# EAGLE schematic id12-breakout (EAGLE 5.10)
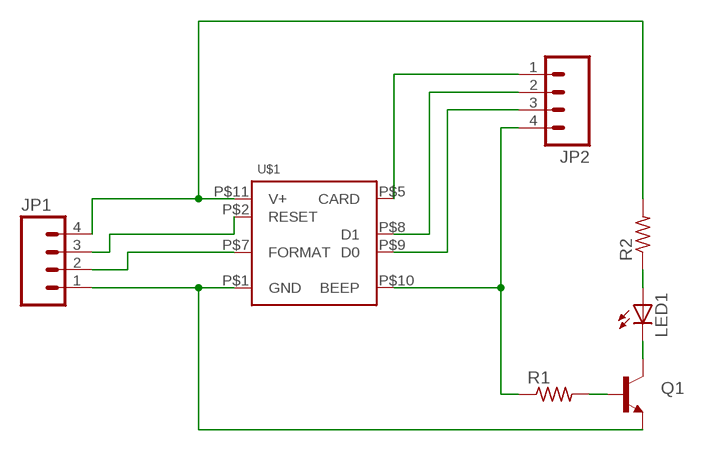
[diagram p0: schematic, sheet 1]

## Parts
JP1  M04LOCK  [1X04_LOCK]
JP2  M04LOCK  [1X04_LOCK]
LED1  LEDCHIP-LED0805  [CHIP-LED0805]
Q1  TRANSISTOR_NPNSOT23  [SOT23]
R1  R-US_M0805  [M0805]
R2  R-US_M0805  [M0805]
U$1  ID-12  [ID-12]

## Nets
N$1: JP2.4 R1.1 U$1.P$10(BEEP)
N$2: Q1.1(B) R1.2
N$3: LED1.C Q1.3(C)
N$4: LED1.A R2.1
N$5: JP1.1 Q1.2(E) U$1.P$1(GND)
N$6: JP1.4 R2.2 U$1.P$11(V+)
N$7: JP1.3 U$1.P$2(RESET)
N$8: JP1.2 U$1.P$7(FORMAT)
N$9: JP2.1 U$1.P$5(CARD)
N$10: JP2.2 U$1.P$8(D1)
N$11: JP2.3 U$1.P$9(D0)

## Library data of the parts
JP1 JP2 = SparkFun:M04: Header 4 Standard 4-pin 0.1" header. Use with straight break away headers (SKU : PRT-00116), right angle break away headers (PRT-00553), swiss pins (PRT-00743), machine pins (PRT-00117), and female headers (PRT-00115). Molex polarized connector foot print use with SKU : PRT-08231 with associated crimp pins and housings. 1MM SMD Version SKU: PRT-10208
LED1 = adafruit:LED: LED OSRAM: - CHIPLED LG R971, LG N971, LY N971, LG Q971, LY Q971, LO R971, LY R971 LH N974, LH R974 LS Q976, LO Q976, LY Q976 LO Q996 - Hyper CHIPLED LW Q18S LB Q993, LB Q99A, LB R99A - SideLED LS A670, LO A670, LY A670, LG A670, LP A670 LB A673, LV A673, LT A673, LW A673 LH A674 LY A675 LS A676, LA A676, LO A676, LY A676, LW A676 LS A679, LY A679, LG A679 - Hyper Micro SIDELED® LS Y876, LA Y876, LO Y876, LY Y876 LT Y87S - SmartLED LW L88C, LW L88S LB L89C, LB L89S, LG L890 LS L89K, LO L89K, LY L89K LS L896, LA L896, LO L896, LY L896 - TOPLED LS T670, LO T670, LY T670, LG T670, LP T670 LSG T670, LSP T670, LSY T670, LOP T670, LYG T670 LG T671, LOG T671, LSG T671 LB T673, LV T673, LT T673, LW T673 LH T674 LS T676, LA T676, LO T676, LY T676, LB T676, LH T676, LSB T676, LW T676 LB T67C, LV T67C, LT T67C, LS T67K, LO T67K, LY T67K, LW E67C LS E67B, LA E67B, LO E67B, LY E67B, LB E67C, LV E67C, LT E67C LW T67C LS T679, LY T679, LG T679 LS T770, LO T770, LY T770, LG T770, LP T770 LB T773, LV T773, LT T773, LW T773 LH T774 LS E675, LA E675, LY E675, LS T675 LS T776, LA T776, LO T776, LY T776, LB T776 LHGB T686 LT T68C, LB T68C - Hyper Mini TOPLED® LB M676 - Mini TOPLED Santana® LG M470 LS M47K, LO M47K, LY M47K Source: http://www.osram.convergy.de/
Q1 = SparkFun:TRANSISTOR_NPN: Transistor NPN BJT configuration in SOT23 package. MMBT2222 is the common NPN we use. Double check BCE configuration again layout.
R1 R2 = rcl:R-US_: RESISTOR, American symbol
U$1 = karlnet-parts:ID-12: ID-12 RFID reader (build in antenna) Available from Sparkfun as https://www.sparkfun.com/products/8419